# Altium schematic sheet PCIe_104.SchDoc
size A4
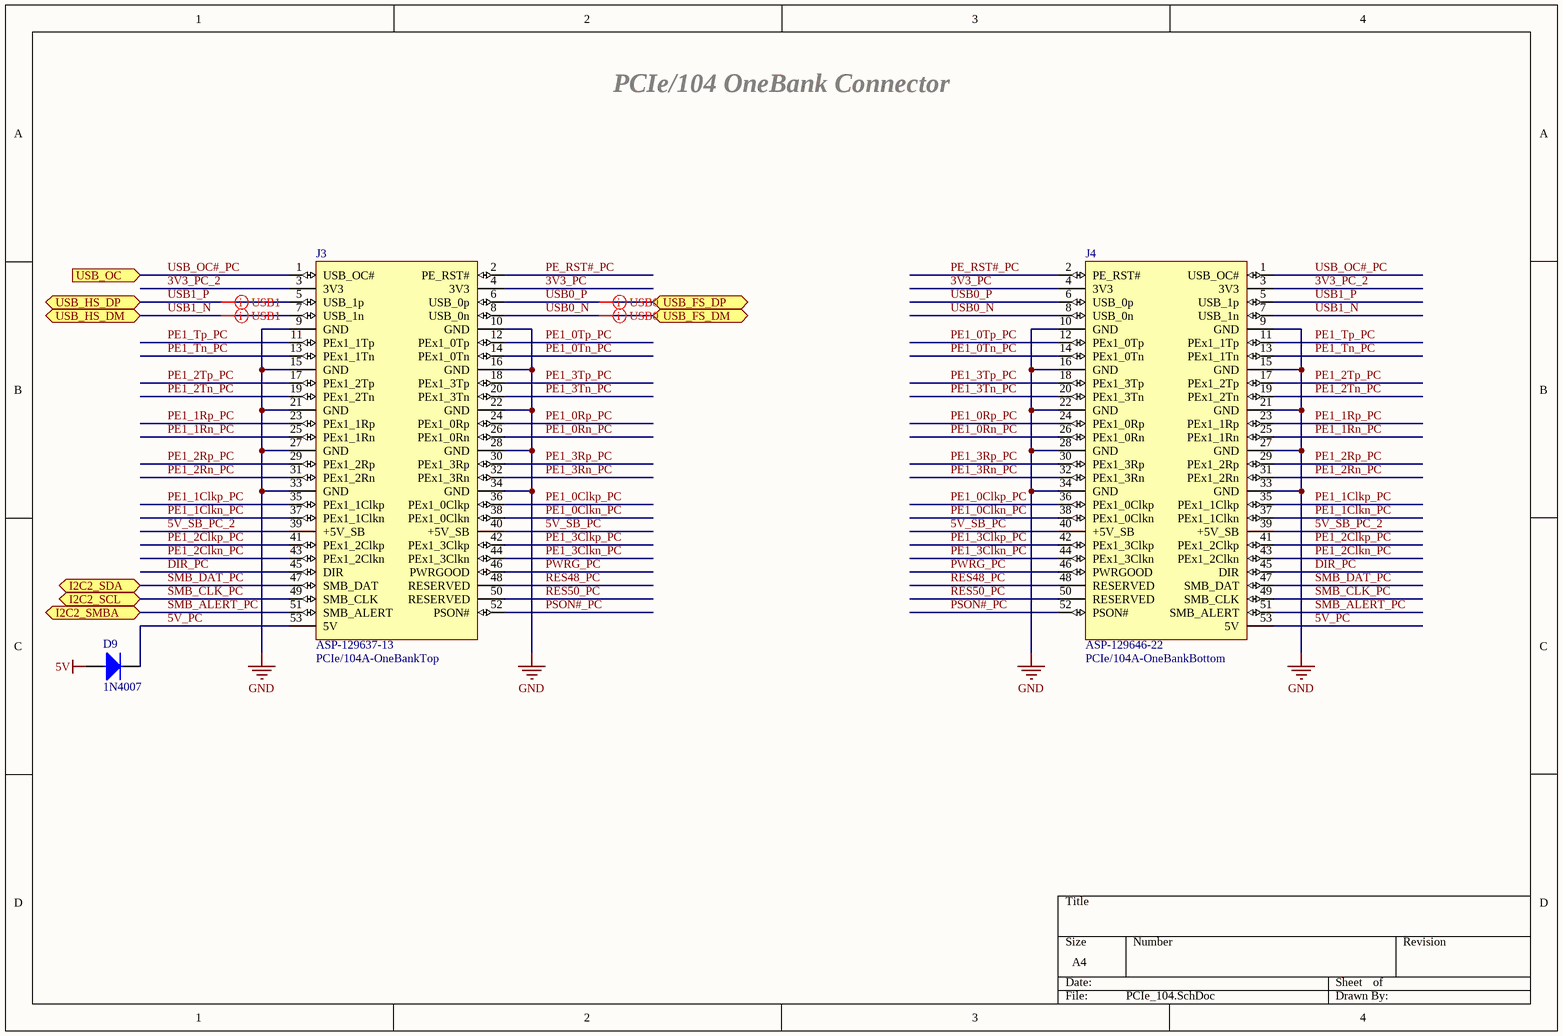
[diagram p0: PCIe_104.SchDoc]

## Parts
D9  1N4007  [SMA (DO-214AC)]
J3  ASP-129637-13  [ASP-129637-13]
J4  ASP-129646-22  [ASP-129646-22]

## Ports
I2C2_SCL (bidir), I2C2_SDA (bidir), I2C2_SMBA (bidir), USB_FS_DM (bidir), USB_FS_DP (bidir), USB_HS_DM (bidir), USB_HS_DP (bidir), USB_OC (in)

## Nets
5V: D9.1
GND: J3.9(GND) J3.10(GND) J3.15(GND) J3.16(GND) J3.21(GND) J3.22(GND) J3.27(GND) J3.28(GND) J3.33(GND) J3.34(GND) J4.9(GND) J4.10(GND) J4.15(GND) J4.16(GND) J4.21(GND) J4.22(GND) J4.27(GND) J4.28(GND) J4.33(GND) J4.34(GND)
3V3_PC: J3.4(3V3) J4.4(3V3)
3V3_PC_2: J3.3(3V3) J4.3(3V3)
5V_PC: D9.2 J3.53(5V) J4.53(5V)
5V_SB_PC: J3.40(+5V_SB) J4.40(+5V_SB)
5V_SB_PC_2: J3.39(+5V_SB) J4.39(+5V_SB)
DIR_PC: J3.45(DIR) J4.45(DIR)
PE1_0Clkn_PC: J3.38(PEx1_0Clkn) J4.38(PEx1_0Clkn)
PE1_0Clkp_PC: J3.36(PEx1_0Clkp) J4.36(PEx1_0Clkp)
PE1_0Rn_PC: J3.26(PEx1_0Rn) J4.26(PEx1_0Rn)
PE1_0Rp_PC: J3.24(PEx1_0Rp) J4.24(PEx1_0Rp)
PE1_0Tn_PC: J3.14(PEx1_0Tn) J4.14(PEx1_0Tn)
PE1_0Tp_PC: J3.12(PEx1_0Tp) J4.12(PEx1_0Tp)
PE1_1Clkn_PC: J3.37(PEx1_1Clkn) J4.37(PEx1_1Clkn)
PE1_1Clkp_PC: J3.35(PEx1_1Clkp) J4.35(PEx1_1Clkp)
PE1_1Rn_PC: J3.25(PEx1_1Rn) J4.25(PEx1_1Rn)
PE1_1Rp_PC: J3.23(PEx1_1Rp) J4.23(PEx1_1Rp)
PE1_2Clkn_PC: J3.43(PEx1_2Clkn) J4.43(PEx1_2Clkn)
PE1_2Clkp_PC: J3.41(PEx1_2Clkp) J4.41(PEx1_2Clkp)
PE1_2Rn_PC: J3.31(PEx1_2Rn) J4.31(PEx1_2Rn)
PE1_2Rp_PC: J3.29(PEx1_2Rp) J4.29(PEx1_2Rp)
PE1_2Tn_PC: J3.19(PEx1_2Tn) J4.19(PEx1_2Tn)
PE1_2Tp_PC: J3.17(PEx1_2Tp) J4.17(PEx1_2Tp)
PE1_3Clkn_PC: J3.44(PEx1_3Clkn) J4.44(PEx1_3Clkn)
PE1_3Clkp_PC: J3.42(PEx1_3Clkp) J4.42(PEx1_3Clkp)
PE1_3Rn_PC: J3.32(PEx1_3Rn) J4.32(PEx1_3Rn)
PE1_3Rp_PC: J3.30(PEx1_3Rp) J4.30(PEx1_3Rp)
PE1_3Tn_PC: J3.20(PEx1_3Tn) J4.20(PEx1_3Tn)
PE1_3Tp_PC: J3.18(PEx1_3Tp) J4.18(PEx1_3Tp)
PE1_Tn_PC: J3.13(PEx1_1Tn) J4.13(PEx1_1Tn)
PE1_Tp_PC: J3.11(PEx1_1Tp) J4.11(PEx1_1Tp)
PE_RST#_PC: J3.2(PE_RST#) J4.2(PE_RST#)
PSON#_PC: J3.52(PSON#) J4.52(PSON#)
PWRG_PC: J3.46(PWRGOOD) J4.46(PWRGOOD)
RES48_PC: J3.48(RESERVED) J4.48(RESERVED)
RES50_PC: J3.50(RESERVED) J4.50(RESERVED)
SMB_ALERT_PC: J3.51(SMB_ALERT) J4.51(SMB_ALERT) ; port I2C2_SMBA
SMB_CLK_PC: J3.49(SMB_CLK) J4.49(SMB_CLK) ; port I2C2_SCL
SMB_DAT_PC: J3.47(SMB_DAT) J4.47(SMB_DAT) ; port I2C2_SDA
USB0_N: J3.8(USB_0n) J4.8(USB_0n) ; port USB_FS_DM
USB0_P: J3.6(USB_0p) J4.6(USB_0p) ; port USB_FS_DP
USB1_N: J3.7(USB_1n) J4.7(USB_1n) ; port USB_HS_DM
USB1_P: J3.5(USB_1p) J4.5(USB_1p) ; port USB_HS_DP
USB_OC#_PC: J3.1(USB_OC#) J4.1(USB_OC#) ; port USB_OC

## Layout directives
differential pair: USB0_N, USB0_P, USB1_N, USB1_P

## Notes on the sheet
- PCIe/104 OneBank Connector

## Library data of the parts
D9 = Diode: Diodo; Cod. Proveedor: DI1202221; Proveedor: Elemon; Encapsulado: SMA; Link: http://www.elemon.net/
J3 = PCIe/104A-OneBankTop: PCIe/104 Connector A, OneBank Top; Cod. Proveedor: SAM10885-ND; Proveedor: Digikey; Encapsulado: Surface Mount; Link: https://www.digikey.com/
J4 = PCIe/104A-OneBankBottom: PCIe/104 Connector A, OneBank Bottom; Cod. Proveedor: SAM10886-ND; Proveedor: Digikey; Encapsulado: Surface Mount; Link: https://www.digikey.com/